# Altium schematic sheet BUTTON.SchDoc
size A; SheetNumber: 5; SheetTotal: 9
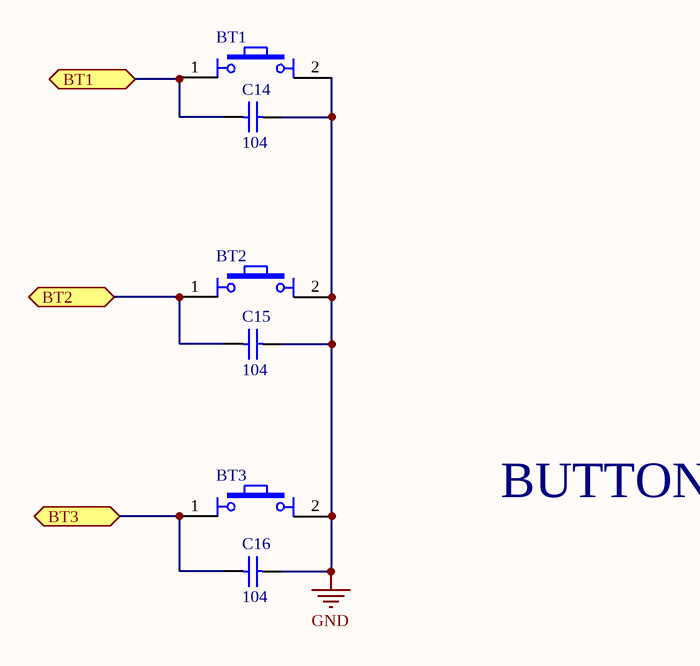
[diagram p0: BUTTON.SchDoc]

## Parts
BT1  Nut Nhan 4 Chan Cam 6x6  [Nut Nhan 4 Chan Cam 6x6]  (value not drawn)
BT2  Nut Nhan 4 Chan Cam 6x6  [Nut Nhan 4 Chan Cam 6x6]  (value not drawn)
BT3  Nut Nhan 4 Chan Cam 6x6  [Nut Nhan 4 Chan Cam 6x6]  (value not drawn)
C14  104  [tu 0603]
C15  104  [tu 0603]
C16  104  [tu 0603]

## Ports
BT1 (bidir), BT2 (bidir), BT3 (bidir)

## Nets
GND: BT1.2 BT2.2 BT3.2 C14.1 C15.1 C16.1
BT1: BT1.1 C14.2 ; port BT1
BT2: BT2.1 C15.2 ; port BT2
BT3: BT3.1 C16.2 ; port BT3

## Notes on the sheet
- BUTTON

## Library data of the parts
BT1-BT3 = Nut Nhan 4 Chan Cam 6x6: Nut Nhan 4 Chan 6x6mm; Ten: Nút Nhấn 4 Chân 6x6x5MM DIP; Ma_Hang: MH004584
C14-C16 = Tu 0603 104 50V 10%: Dán; Don_Vi: Con; So_Chan: 2; Ten_Linh_Kien: Tụ 0603 104-100nF 10% 50V; Ma_Hang: MH004568; Chung_Loai: Dán; Kieu_Chan: *